# EasyEDA schematic Controll Board_2020-08-23_19-58-41.json
TITLE: Sheet_2; REV: 1.0; Date: 2020-08-06; Sheet: 1/1; Drawn By: Saviano Luz; Company: Your Company
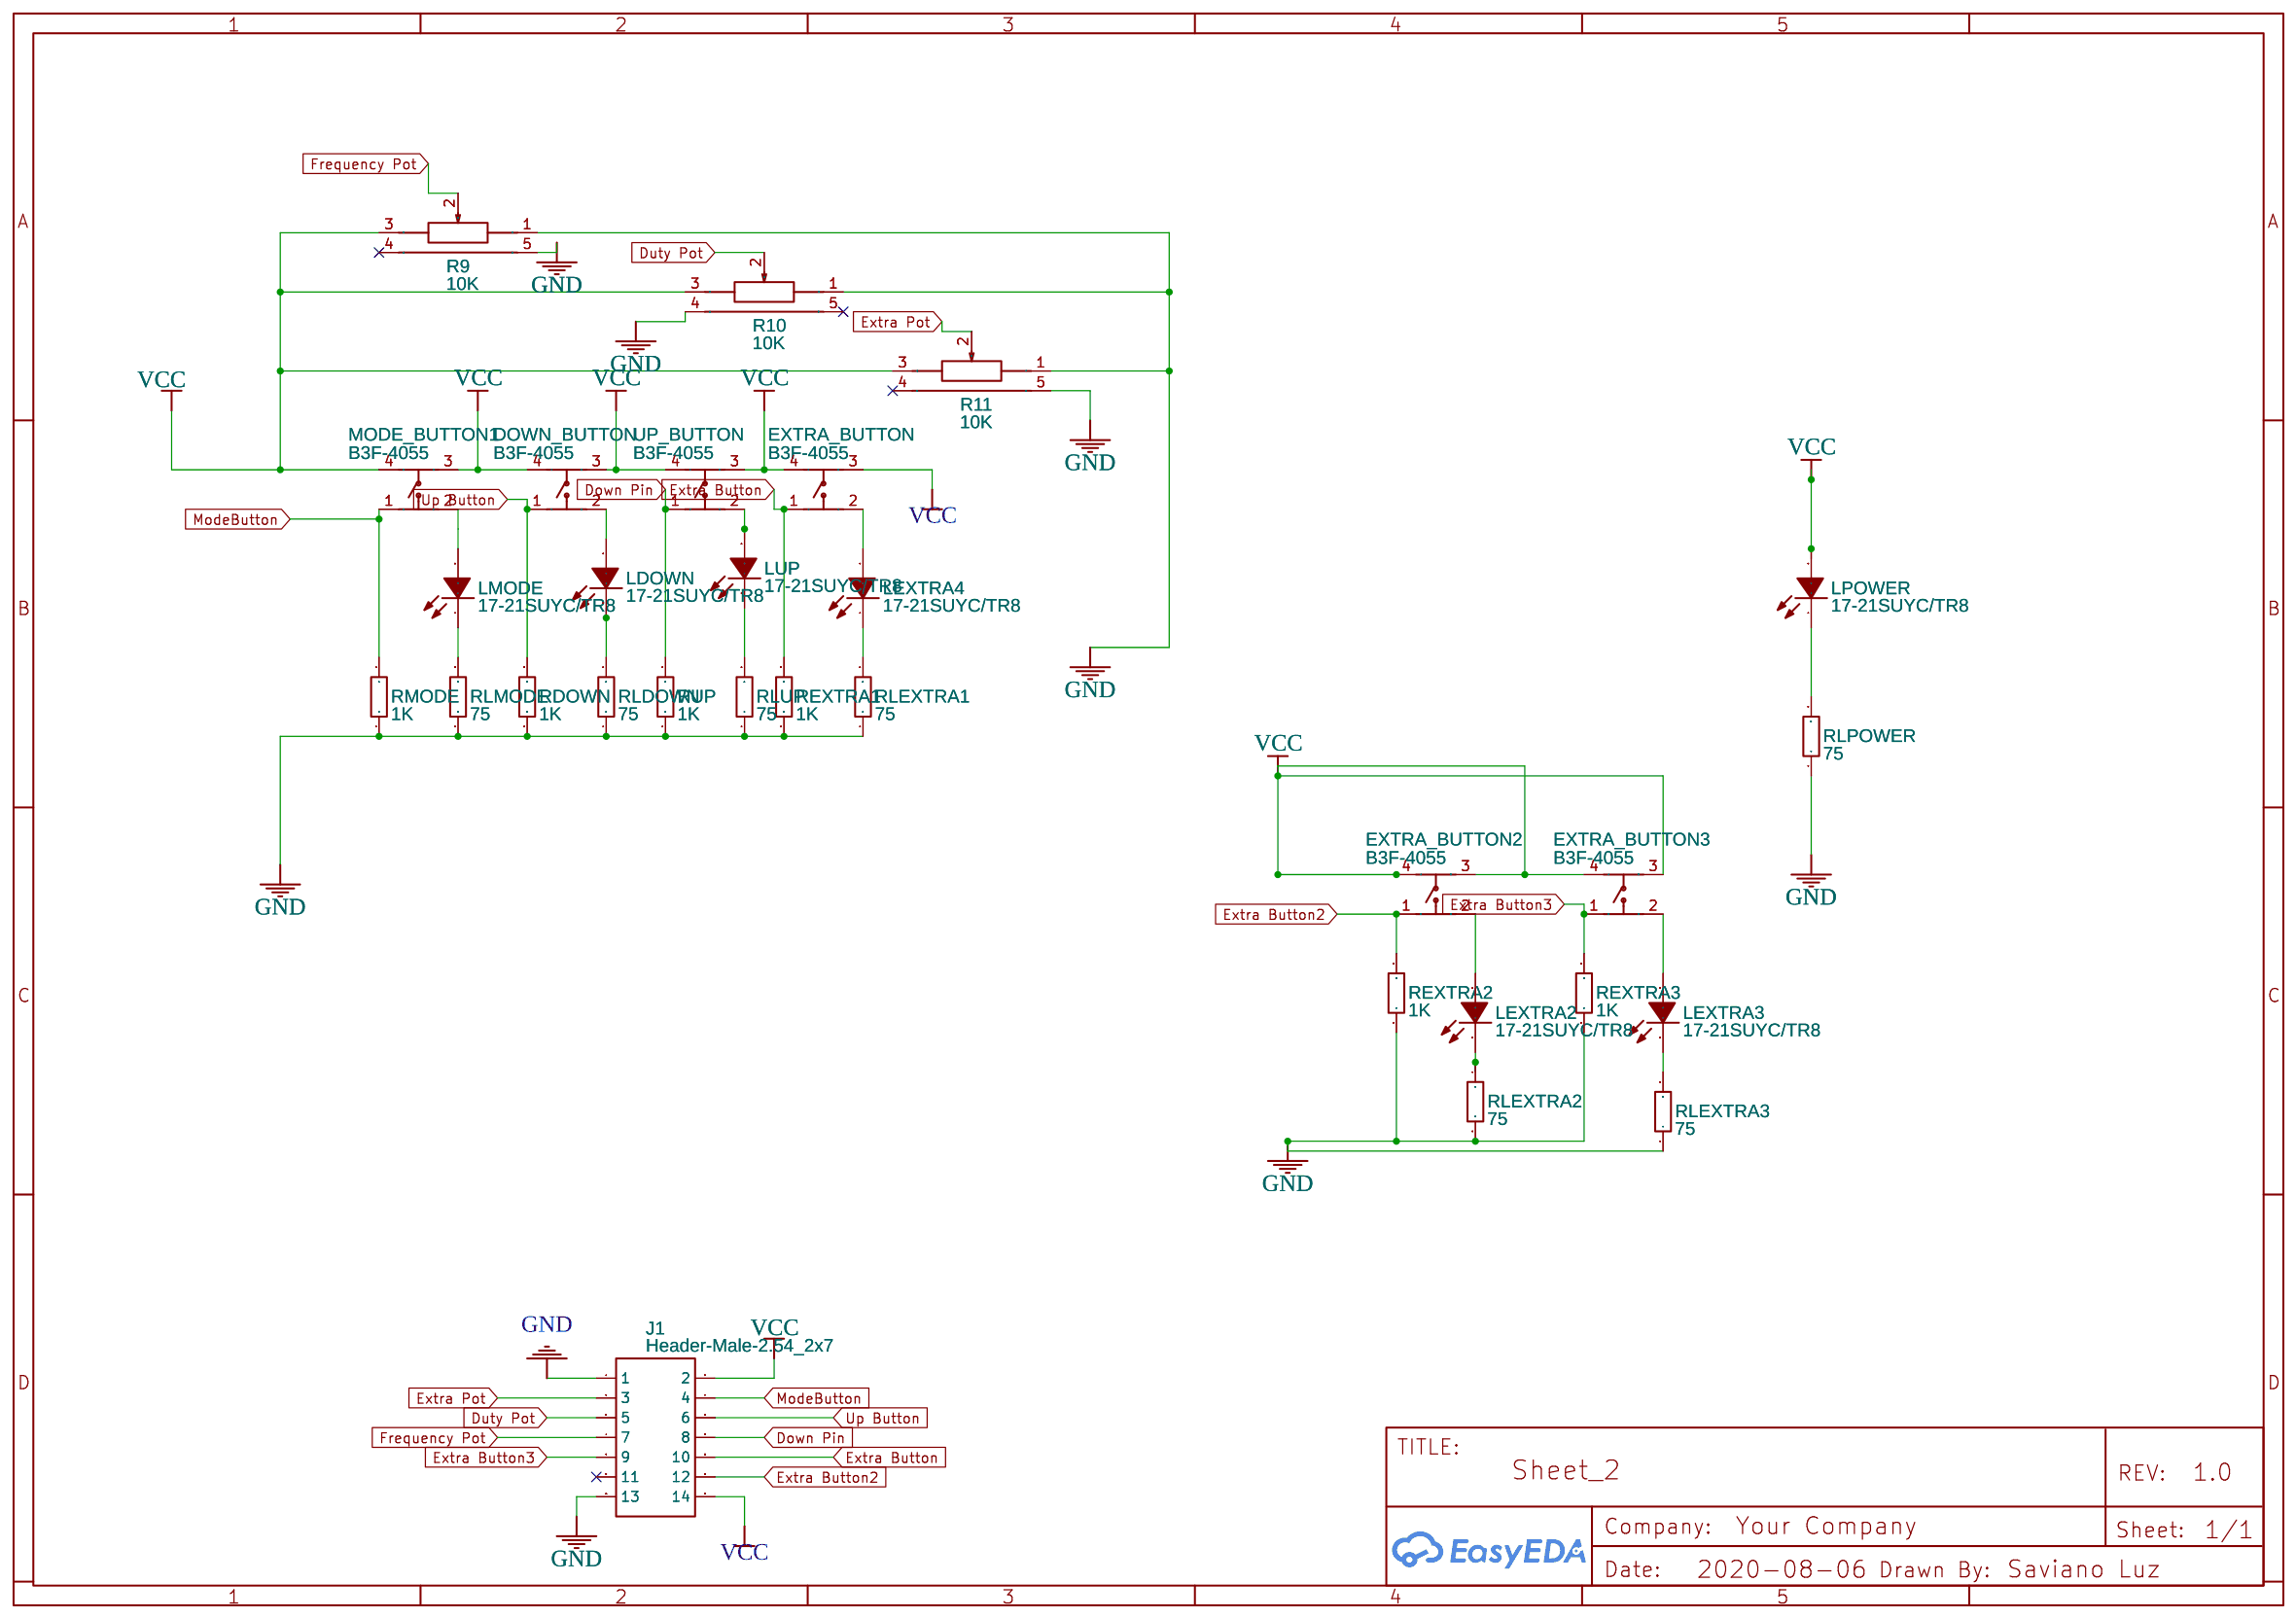
[diagram p0: schematic sheet]

## Parts
DOWN_BUTTON  B3F-4055  [KEY-TH_4P-L12.0-W12.0-P5.00-LS13.4-EH]
EXTRA_BUTTON  B3F-4055  [KEY-TH_4P-L12.0-W12.0-P5.00-LS13.4-EH]
EXTRA_BUTTON2  B3F-4055  [KEY-TH_4P-L12.0-W12.0-P5.00-LS13.4-EH]
EXTRA_BUTTON3  B3F-4055  [KEY-TH_4P-L12.0-W12.0-P5.00-LS13.4-EH]
J1  Header-Male-2.54_2x7  [HDR-TH_14P-P2.54-V-R2-C7-S2.54]
LDOWN  17-21SUYC/TR8  [LED0805-RD]
LEXTRA2  17-21SUYC/TR8  [LED0805-RD]
LEXTRA3  17-21SUYC/TR8  [LED0805-RD]
LEXTRA4  17-21SUYC/TR8  [LED0805-RD]
LMODE  17-21SUYC/TR8  [LED0805-RD]
LPOWER  17-21SUYC/TR8  [LED0805-RD]
LUP  17-21SUYC/TR8  [LED0805-RD]
MODE_BUTTON1  B3F-4055  [KEY-TH_4P-L12.0-W12.0-P5.00-LS13.4-EH]
R9  10K  [RES-TH_RK09K1130AAU]
R10  10K  [RES-TH_RK09K1130AAU]
R11  10K  [RES-TH_RK09K1130AAU]
RDOWN  1K  [R0805]
REXTRA1  1K  [R0805]
REXTRA2  1K  [R0805]
REXTRA3  1K  [R0805]
RLDOWN  75  [R0805]
RLEXTRA1  75  [R0805]
RLEXTRA2  75  [R0805]
RLEXTRA3  75  [R0805]
RLMODE  75  [R0805]
RLPOWER  75  [R0805]
RLUP  75  [R0805]
RMODE  1K  [R0805]
RUP  1K  [R0805]
UP_BUTTON  B3F-4055  [KEY-TH_4P-L12.0-W12.0-P5.00-LS13.4-EH]

## Library data of the parts
DOWN_BUTTON EXTRA_BUTTON EXTRA_BUTTON2 EXTRA_BUTTON3 MODE_BUTTON1 UP_BUTTON = B3F-4055: Supplier: LCSC; Manufacturer: OMRON; Supplier Part: C84931
J1 = Header-Male-2.54_2x7: Supplier: LCSC; Manufacturer: BOOMELE; Manufacturer Part: Double row of needle2X7P 2.54mm; Supplier Part: C71397
LDOWN LEXTRA2-LEXTRA4 LMODE LPOWER LUP = 17-21SUYC/TR8: Supplier: LCSC; Manufacturer: KENTO; LCSC Assembly: Yes; image: //image.lceda.cn/szlcsc/C2296.jpg; Supplier Part: C2296; SMT Type: Basic
R9-R11 = RK09K1130AAU: Supplier: LCSC; Supplier Part: C202373; Manufacturer: ALPS Electric; Contributor: LCSC
RDOWN REXTRA1-REXTRA3 RMODE RUP = 0805W8F1001T5E: Supplier: LCSC; Manufacturer: UniOhm; LCSC Assembly: Yes; Supplier Part: C17513; SMT Type: Basic
RLDOWN RLEXTRA1-RLEXTRA3 RLMODE RLPOWER RLUP = 0805W8F750JT5E: Supplier: LCSC; Manufacturer: UniOhm; LCSC Assembly: Yes; Supplier Part: C20638; SMT Type: Basic

## Nets
GND: J1.1 J1.13 R9.1 R9.5(EH) R10.1 R10.4(EH) R11.1 R11.5(EH) RDOWN.1 REXTRA1.1 REXTRA2.1 REXTRA3.1 RLDOWN.1 RLEXTRA1.1 RLEXTRA2.2 RLEXTRA3.1 RLMODE.1 RLPOWER.1 RLUP.1 RMODE.1 RUP.1
VCC: DOWN_BUTTON.3 DOWN_BUTTON.4 EXTRA_BUTTON.3 EXTRA_BUTTON.4 EXTRA_BUTTON2.3 EXTRA_BUTTON2.4 EXTRA_BUTTON3.3 EXTRA_BUTTON3.4 J1.2 J1.14 LPOWER.2(+) MODE_BUTTON1.3 MODE_BUTTON1.4 R9.3 R10.3 R11.3 UP_BUTTON.3 UP_BUTTON.4
Down Pin: J1.8 RUP.2 UP_BUTTON.1
Duty Pot: J1.5 R10.2
Extra Button: EXTRA_BUTTON.1 J1.10 REXTRA1.2
Extra Button2: EXTRA_BUTTON2.1 J1.12 REXTRA2.2
Extra Button3: EXTRA_BUTTON3.1 J1.9 REXTRA3.2
Extra Pot: J1.3 R11.2
Frequency Pot: J1.7 R9.2
ModeButton: J1.4 MODE_BUTTON1.1 RMODE.2
Up Button: DOWN_BUTTON.1 J1.6 RDOWN.2
Net-(DOWN_BUTTON-2): DOWN_BUTTON.2 LDOWN.2(+)
Net-(EXTRA_BUTTON2-2): EXTRA_BUTTON2.2 LEXTRA2.2(+)
Net-(EXTRA_BUTTON3-2): EXTRA_BUTTON3.2 LEXTRA3.2(+)
Net-(EXTRA_BUTTON-2): EXTRA_BUTTON.2 LEXTRA4.2(+)
Net-(LDOWN-1): LDOWN.1(-) RLDOWN.2
Net-(LEXTRA2-1): LEXTRA2.1(-) RLEXTRA2.1
Net-(LEXTRA3-1): LEXTRA3.1(-) RLEXTRA3.2
Net-(LEXTRA4-1): LEXTRA4.1(-) RLEXTRA1.2
Net-(LMODE-1): LMODE.1(-) RLMODE.2
Net-(LMODE-2): LMODE.2(+) MODE_BUTTON1.2
Net-(LPOWER-1): LPOWER.1(-) RLPOWER.2
Net-(LUP-1): LUP.1(-) RLUP.2
Net-(LUP-2): LUP.2(+) UP_BUTTON.2

Not connected (* = marked no-connect by the designer): J1 11*; R9 4(EH)*; R10 5(EH)*; R11 4(EH)*
